# EAGLE design RxT6 (EAGLE 4.13)
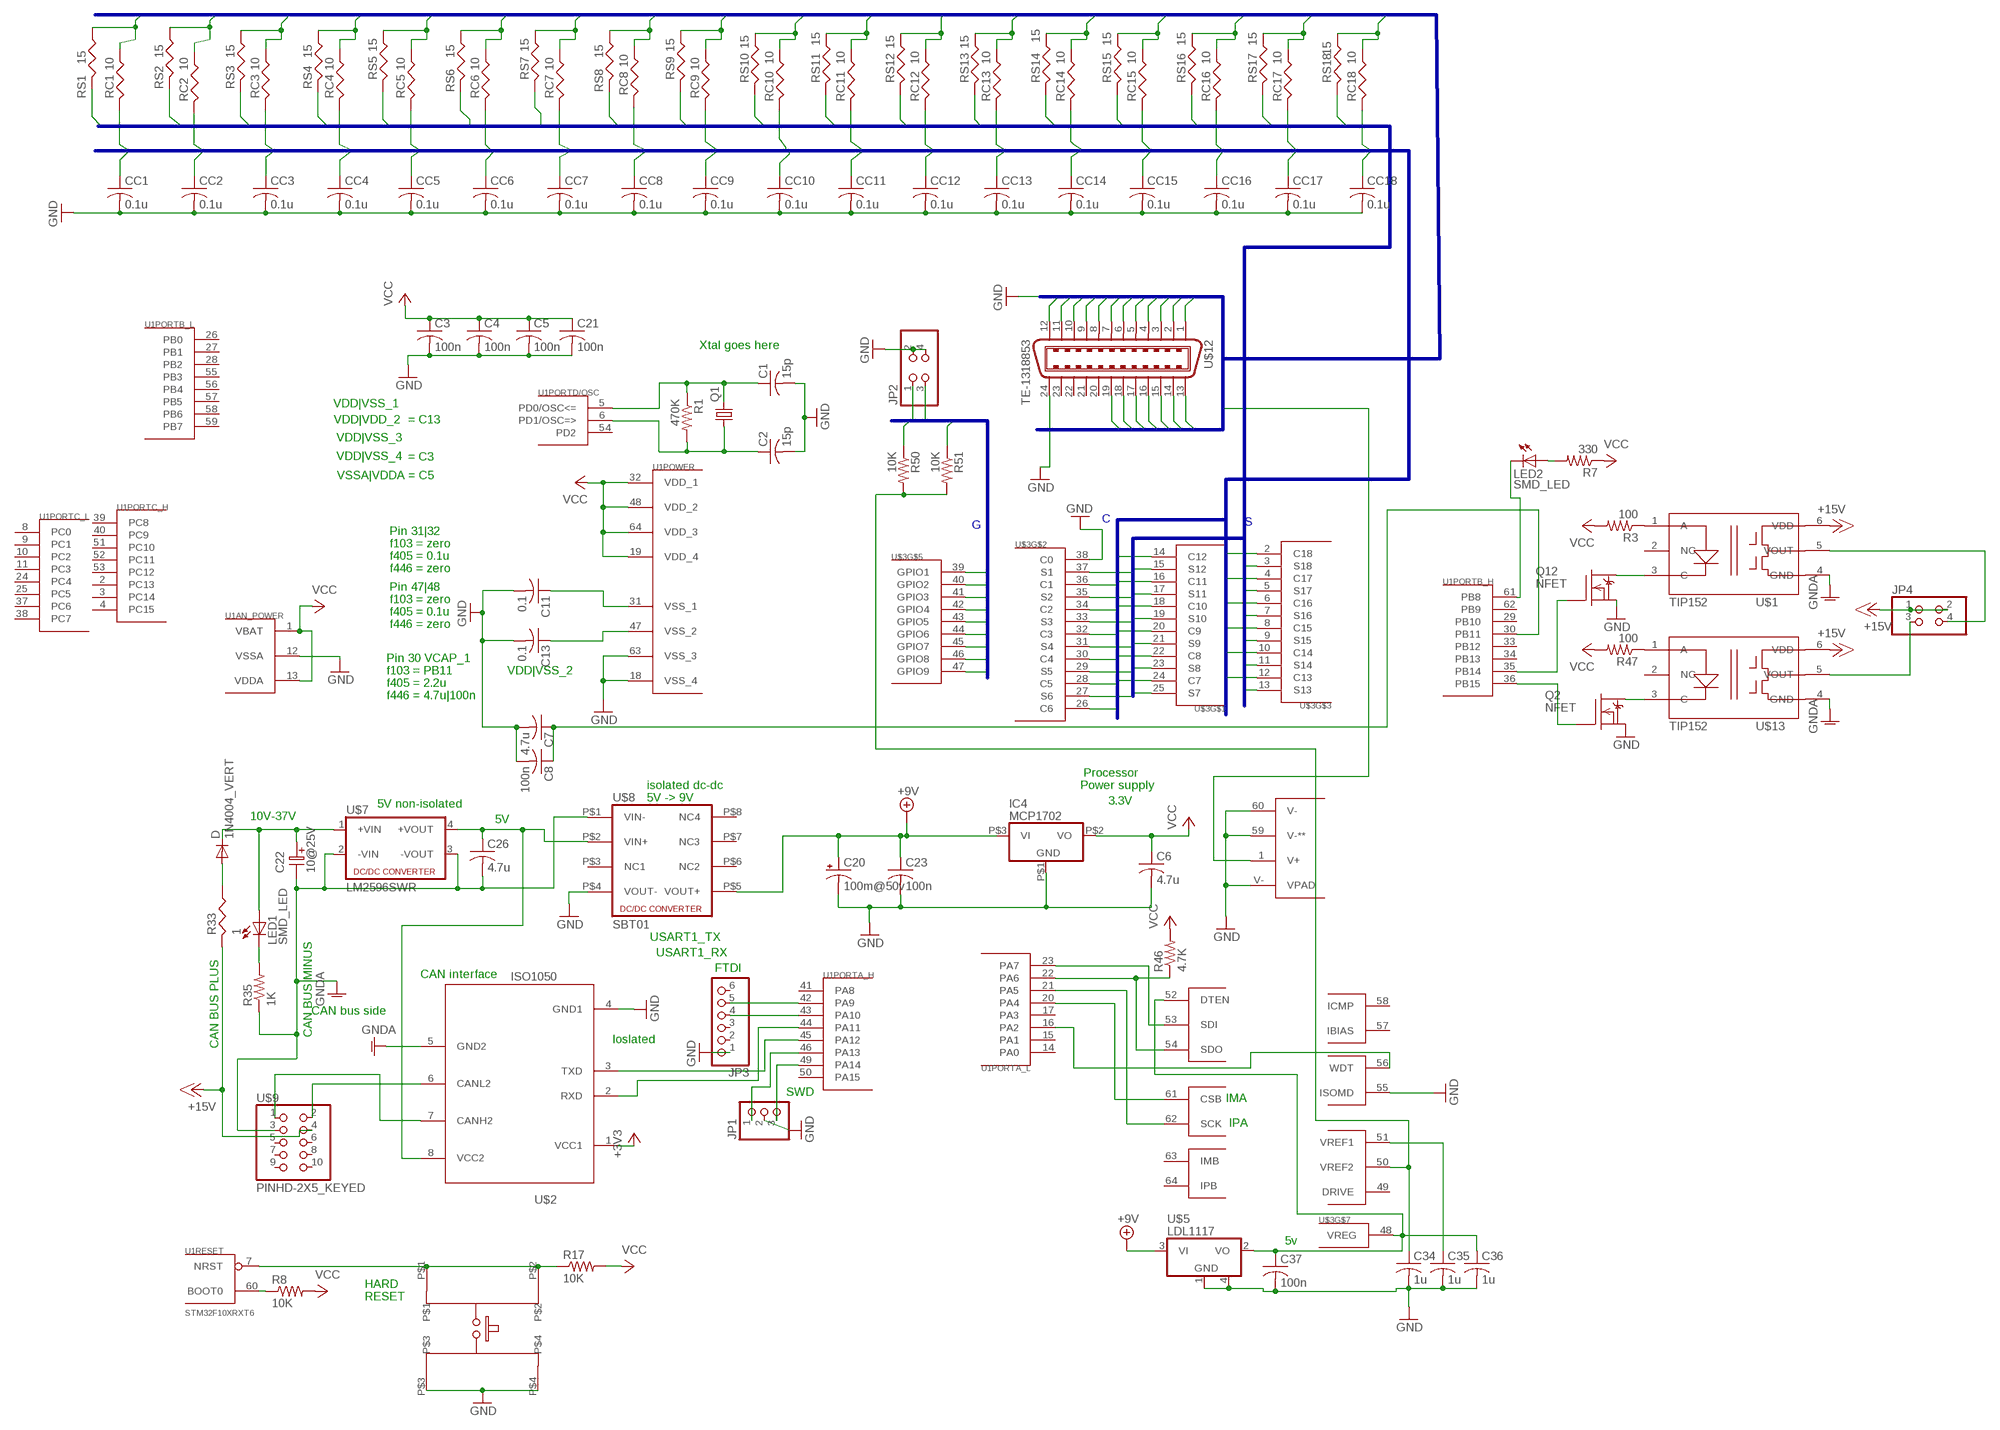
[diagram p0: schematic, sheet 1]

## Parts
C1  15p  C-USC0603  [C0603]
C2  15p  C-USC0603  [C0603]
C3  100n  C-USC0603  [C0603]
C4  100n  C-USC0603  [C0603]
C5  100n  C-USC0603  [C0603]
C6  4.7u  C-USC0805  [C0805]
C7  4.7u  C-USC0603  [C0603]
C8  100n  C-USC0603  [C0603]
C11  0.1  C-USC0603  [C0603]
C13  0.1  C-USC0603  [C0603]
C20  100m@50v  CPOL-USE5-8.5  [E5-8,5]
C21  100n  C-USC0603  [C0603]
C22  10@25V  ELC-2,5L  [ES-2,5L]
C23  100n  C-USC0603  [C0603]
C26  4.7u  C-USC0603  [C0603]
C34  1u  C-USC0603  [C0603]
C35  1u  C-USC0603  [C0603]
C36  1u  C-USC0603  [C0603]
C37  100n  C-USC0603  [C0603]
CC1  0.1u  C-USC0805  [C0805]
CC2  0.1u  C-USC0805  [C0805]
CC3  0.1u  C-USC0805  [C0805]
CC4  0.1u  C-USC0805  [C0805]
CC5  0.1u  C-USC0805  [C0805]
CC6  0.1u  C-USC0805  [C0805]
CC7  0.1u  C-USC0805  [C0805]
CC8  0.1u  C-USC0805  [C0805]
CC9  0.1u  C-USC0805  [C0805]
CC10  0.1u  C-USC0805  [C0805]
CC11  0.1u  C-USC0805  [C0805]
CC12  0.1u  C-USC0805  [C0805]
CC13  0.1u  C-USC0805  [C0805]
CC14  0.1u  C-USC0805  [C0805]
CC15  0.1u  C-USC0805  [C0805]
CC16  0.1u  C-USC0805  [C0805]
CC17  0.1u  C-USC0805  [C0805]
CC18  0.1u  C-USC0805  [C0805]
D  1N4004_VERT  [DO41-10_VERT]
IC4  MCP1702  [SOT-23A]
JP1  PINHD-1X3  [1X03]
JP2  PINHD-2X2  [2X02]
JP3  PINHD-1X6  [1X06]
JP4  PINHD-2X2  [2X02]
LED1  SMD_LED  [SMD_LED]
LED2  SMD_LED  [SMD_LED]
Q1  CRYTALHC49S  [HC49/S]
Q2  NFET  DMN3404L  [SOT-23]
Q12  NFET  DMN3404L  [SOT-23]
R1  470K  R-US_R0603  [R0603]
R3  100  R-US_R0603  [R0603]
R7  330  R-US_R0603  [R0603]
R8  10K  R-US_R0603  [R0603]
R17  10K  R-US_R0603  [R0603]
R33  1  RESUS-S2,5  [RS-2,5]
R35  1K  R-US_R0603  [R0603]
R46  4.7K  R-US_R0603  [R0603]
R47  100  R-US_R0603  [R0603]
R50  10K  R-US_R0603  [R0603]
R51  10K  R-US_R0603  [R0603]
RC1  10  RESUS-S2,5  [RS-2,5]
RC2  10  RESUS-S2,5  [RS-2,5]
RC3  10  RESUS-S2,5  [RS-2,5]
RC4  10  RESUS-S2,5  [RS-2,5]
RC5  10  RESUS-S2,5  [RS-2,5]
RC6  10  RESUS-S2,5  [RS-2,5]
RC7  10  RESUS-S2,5  [RS-2,5]
RC8  10  RESUS-S2,5  [RS-2,5]
RC9  10  RESUS-S2,5  [RS-2,5]
RC10  10  RESUS-S2,5  [RS-2,5]
RC11  10  RESUS-S2,5  [RS-2,5]
RC12  10  RESUS-S2,5  [RS-2,5]
RC13  10  RESUS-S2,5  [RS-2,5]
RC14  10  RESUS-S2,5  [RS-2,5]
RC15  10  RESUS-S2,5  [RS-2,5]
RC16  10  RESUS-S2,5  [RS-2,5]
RC17  10  RESUS-S2,5  [RS-2,5]
RC18  10  RESUS-S2,5  [RS-2,5]
RS1  15  RESUS-S2,5  [RS-2,5]
RS2  15  RESUS-S2,5  [RS-2,5]
RS3  15  RESUS-S2,5  [RS-2,5]
RS4  15  RESUS-S2,5  [RS-2,5]
RS5  15  RESUS-S2,5  [RS-2,5]
RS6  15  RESUS-S2,5  [RS-2,5]
RS7  15  RESUS-S2,5  [RS-2,5]
RS8  15  RESUS-S2,5  [RS-2,5]
RS9  15  RESUS-S2,5  [RS-2,5]
RS10  15  RESUS-S2,5  [RS-2,5]
RS11  15  RESUS-S2,5  [RS-2,5]
RS12  15  RESUS-S2,5  [RS-2,5]
RS13  15  RESUS-S2,5  [RS-2,5]
RS14  15  RESUS-S2,5  [RS-2,5]
RS15  15  RESUS-S2,5  [RS-2,5]
RS16  15  RESUS-S2,5  [RS-2,5]
RS17  15  RESUS-S2,5  [RS-2,5]
RS18  15  RESUS-S2,5  [RS-2,5]
SW1  E-SWITCH  [E-SWITCH]
U1  STM32F10XRXT6  [TQFP64]
U$1  TIP152  SI826  [SDIP6]
U$2  ISO1050  [PDSO-G8]
U$3  LTC6813  [TQFP64_PAD]
U$5  LDL1117  [SO223]
U$7  LM2596SWR  [LM2596SW]
U$8  SBT01  [SBT01]
U$9  PINHD-2X5_KEYED  [2X05_KEYED]
U$12  TE-1318853  [TE-CONN-24]
U$13  TIP152  SI826  [SDIP6]

## Nets
5V_CANSIDE: C26.1 U$2.8(VCC2) U$7.4(+VOUT) U$8.P$2(VIN+)
+3V3: U$2.1(VCC1)
+9V: C20.+ C23.1 IC4.P$3(VI) U$5.3(VI) U$8.P$5(VOUT+)
+12V_RESISTORED: D.A R33.1
+15V: JP4.1 JP4.2 R33.2 U$1.6(VDD) U$9.4 U$13.6(VDD)
BOOT0: R8.1 U1.60(RESET:BOOT0)
C1: CC1.1 RC1.2 U$3.36(C1)
C2: CC2.1 RC2.2 U$3.34(C2)
C3: CC3.1 RC3.2 U$3.32(C3)
C4: CC4.1 RC4.2 U$3.30(C4)
C5: CC5.1 RC5.2 U$3.28(C5)
C6: CC6.1 RC6.2 U$3.26(C6)
C7: CC7.1 RC7.2 U$3.24(C7)
C8: CC8.1 RC8.2 U$3.22(C8)
C9: CC9.1 RC9.2 U$3.20(C9)
C10: CC10.1 RC10.2 U$3.18(C10)
C11: CC11.1 RC11.2 U$3.16(C11)
C12: CC12.1 RC12.2 U$3.14(C12)
C13: CC13.1 RC13.2 U$3.12(C13)
C14: CC14.1 RC14.2 U$3.10(C14)
C15: CC15.1 RC15.2 U$3.8(C15)
C16: CC16.1 RC16.2 U$3.6(C16)
C17: CC17.1 RC17.2 U$3.4(C17)
C18: CC18.1 RC18.2 U$3.2(C18)
CAN_PROTECTED+: C22.1 D.C LED1.A U$7.1(+VIN)
CANH: U$2.7(CANH2) U$9.1
CANL: U$2.6(CANL2) U$9.2
G1: JP2.1 R50.1 U$3.39(GPIO1)
G2: JP2.3 R51.1 U$3.40(GPIO2)
G3: U$3.41(GPIO3)
G4: U$3.42(GPIO4)
G5: U$3.43(GPIO5)
G6: U$3.44(GPIO6)
G7: U$3.45(GPIO7)
G8: U$3.46(GPIO8)
G9: U$3.47(GPIO9)
GND: C1.2 C2.2 C3.2 C4.2 C5.2 C6.2 C7.2 C8.2 C11.2 C13.2 C20.- C21.2 C23.2 C34.2 C35.2 C36.2 C37.2 CC1.2 CC2.2 CC3.2 CC4.2 CC5.2 CC6.2 CC7.2 CC8.2 CC9.2 CC10.2 CC11.2 CC12.2 CC13.2 CC14.2 CC15.2 CC16.2 CC17.2 CC18.2 IC4.P$1(GND) JP1.2 JP2.2 JP2.4 JP3.1 Q2.2(S) Q12.2(S) SW1.P$3 SW1.P$4 U1.12(AN_POWER:VSSA) U1.18(POWER:VSS_4) U1.63(POWER:VSS_3) U$2.4(GND1) U$3.38(C0) U$3.55(ISOMD) U$3.59(V-**) U$3.60(V-) U$3.V-(VPAD) U$5.1(GND) U$5.4(GND1) U$8.P$4(VOUT-) U$12.24
GNDA: C22.2 C26.2 R35.1 U$1.4(GND) U$2.5(GND2) U$7.2(-VIN) U$7.3(-VOUT) U$8.P$1(VIN-) U$9.3 U$13.4(GND)
JTCK: JP1.3 U1.49(PORTA_H:PA14)
JTMS: JP1.1 U1.46(PORTA_H:PA13)
LED_BUS_PWR: LED1.C R35.2
LED|R: LED2.A R7.2
N$3: JP4.3 U$13.5(VOUT)
N$8: JP4.4 U$1.5(VOUT)
N$10: R3.1 U$1.1(A)
N$11: R47.1 U$13.1(A)
N$12: Q12.3(D) U$1.3(C)
N$13: Q2.3(D) U$13.3(C)
N$14: Q2.1(G) U1.36(PORTB_H:PB15)
N$15: Q12.1(G) U1.35(PORTB_H:PB14)
NRST: R17.1 SW1.P$1 SW1.P$2 U1.7(RESET:NRST)
PA2|WDT: U1.16(PORTA_L:PA2) U$3.56(WDT)
PA9_USART1_TX: JP3.5 U1.42(PORTA_H:PA9)
PA10_USART1_RX: JP3.4 U1.43(PORTA_H:PA10)
PA11_CANRXD: U1.44(PORTA_H:PA11) U$2.2(RXD)
PA12-CANTXD: U1.45(PORTA_H:PA12) U$2.3(TXD)
PB8|LED: LED2.C U1.61(PORTB_H:PB8)
PB11|VCAP: C7.1 C8.1 U1.30(PORTB_H:PB11)
PD0_OSC_IN_XTAL: C1.1 Q1.2 R1.1 U1.5(PORTD/OSC:PD0/OSC<=)
PD1_OSC_OUT: C2.1 Q1.1 R1.2 U1.6(PORTD/OSC:PD1/OSC=>)
S1: RS1.2 U$3.37(S1)
S2: RS2.2 U$3.35(S2)
S3: RS3.2 U$3.33(S3)
S4: RS4.2 U$3.31(S4)
S5: RS5.2 U$3.29(S5)
S6: RS6.2 U$3.27(S6)
S7: RS7.2 U$3.25(S7)
S8: RS8.2 U$3.23(S8)
S9: RS9.2 U$3.21(S9)
S10: RS10.2 U$3.19(S10)
S11: RS11.2 U$3.17(S11)
S12: RS12.2 U$3.15(S12)
S13: RS13.2 U$3.13(S13)
S14: RS14.2 U$3.11(S14)
S15: RS15.2 U$3.9(S15)
S16: RS16.2 U$3.7(S16)
S17: RS17.2 U$3.5(S17)
S18: RS18.2 U$3.3(S18)
SP1_MISO-SDO: R46.1 U1.22(PORTA_L:PA6) U$3.54(SDO)
SP1_NSS-CSB: U1.20(PORTA_L:PA4) U$3.61(CSB)
SPI1_MOSI-SDI: U1.23(PORTA_L:PA7) U$3.53(SDI)
SPI1_SCK-CLK: U1.21(PORTA_L:PA5) U$3.62(SCK)
VCC: C3.1 C4.1 C5.1 C6.1 C21.1 IC4.P$2(VO) R3.2 R7.1 R8.2 R17.2 R46.2 R47.2 U1.1(AN_POWER:VBAT) U1.13(AN_POWER:VDDA) U1.19(POWER:VDD_4) U1.32(POWER:VDD_1) U1.48(POWER:VDD_2) U1.64(POWER:VDD_3)
VREF1: C35.1 U$3.51(VREF1)
VREF2: C34.1 R50.2 R51.2 U$3.50(VREF2)
VREG: C36.1 C37.1 U$3.48(VREG) U$3.52(DTEN) U$5.2(VO)
VSS_1: C11.1 U1.31(POWER:VSS_1)
VSS_2: C13.1 U1.47(POWER:VSS_2)
X0: U$12.1
X1: RC1.1 RS1.1 U$12.2
X2: RC2.1 RS2.1 U$12.3
X3: RC3.1 RS3.1 U$12.4
X4: RC4.1 RS4.1 U$12.5
X5: RC5.1 RS5.1 U$12.6
X6: RC6.1 RS6.1 U$12.7
X7: RC7.1 RS7.1 U$12.8
X8: RC8.1 RS8.1 U$12.9
X9: RC9.1 RS9.1 U$12.10
X10: RC10.1 RS10.1 U$12.11
X11: RC11.1 RS11.1 U$12.12
X12: RC12.1 RS12.1 U$12.13
X13: RC13.1 RS13.1 U$12.14
X14: RC14.1 RS14.1 U$12.15
X15: RC15.1 RS15.1 U$12.16
X16: RC16.1 RS16.1 U$12.17
X17: RC17.1 RS17.1 U$12.18
X18: RC18.1 RS18.1 U$3.1(V+) U$12.19
Unconnected: JP3.2 JP3.3 JP3.6 U1.2(PORTC_H:PC13) U1.3(PORTC_H:PC14) U1.4(PORTC_H:PC15) U1.8(PORTC_L:PC0) U1.9(PORTC_L:PC1) U1.10(PORTC_L:PC2) U1.11(PORTC_L:PC3) U1.14(PORTA_L:PA0) U1.15(PORTA_L:PA1) U1.17(PORTA_L:PA3) U1.24(PORTC_L:PC4) U1.25(PORTC_L:PC5) U1.26(PORTB_L:PB0) U1.27(PORTB_L:PB1) U1.28(PORTB_L:PB2) U1.29(PORTB_H:PB10) U1.33(PORTB_H:PB12) U1.34(PORTB_H:PB13) U1.37(PORTC_L:PC6) U1.38(PORTC_L:PC7) U1.39(PORTC_H:PC8) U1.40(PORTC_H:PC9) U1.41(PORTA_H:PA8) U1.50(PORTA_H:PA15) U1.51(PORTC_H:PC10) U1.52(PORTC_H:PC11) U1.53(PORTC_H:PC12) U1.54(PORTD/OSC:PD2) U1.55(PORTB_L:PB3) U1.56(PORTB_L:PB4) U1.57(PORTB_L:PB5) U1.58(PORTB_L:PB6) U1.59(PORTB_L:PB7) U1.62(PORTB_H:PB9) U$1.2(NC) U$3.57(IBIAS) U$3.58(ICMP) U$3.63(IMB) U$3.64(IPB) U$8.P$3(NC1) U$8.P$6(NC2) U$8.P$7(NC3) U$8.P$8(NC4) U$9.5 U$9.6 U$9.7 U$9.8 U$9.9 U$9.10 U$12.20 U$12.21 U$12.22 U$12.23 U$13.2(NC)

## Buses
G[1..9]
C[0..18]
X[1..18],GND
S[1..18]

## Notes on the sheet
- Xtal goes here
- VDD|VSS_1
- VDD|VDD_2 | = C13
- VDD|VSS_3
- VDD|VSS_4
- = C3
- VSSA|VDDA = C5
- C | S
- G
- Pin 31|32
- f103 = zero
- f405 = 0.1u
- f446 = zero
- Pin 47|48
- f103 = zero
- f405 = 0.1u
- f446 = zero
- Pin 30 VCAP_1
- f103 = PB11 | VDD|VSS_2
- f405 = 2.2u
- f446 = 4.7u|100n
- Processor
- isolated dc-dc | Power supply
- 5V -> 9V | 3.3V
- 5V non-isolated
- 10V-37V | 5V
- USART1_TX
- CAN BUS PLUS | USART1_RX
- FTDI
- CAN interface
- CAN bus side
- CAN BUS MINUS
- Ioslated
- SWD
- IMA
- IPA
- 5v
- HARD
- RESET

## Power pins joined to a net without a drawn wire
DRIVE: U$3.49(DRIVE)

## Library data of the parts
C1-C8 C11 C13 C21 C23 C26 C34-C37 CC1-CC18 = rcl:C-US: CAPACITOR, American symbol
C20 = rcl:CPOL-US: POLARIZED CAPACITOR, American symbol
C22 = DEH:ELC-2,5L
D = diode:1N4004_VERT
IC4 = linear:MCP1702
JP1 = pinhead:PINHD-1X3: PIN HEADER
JP2 JP4 = pinhead:PINHD-2X2: PIN HEADER
JP3 = pinhead:PINHD-1X6: PIN HEADER
LED1 LED2 = led:SMD_LED
Q1 = crystal:CRYTAL: CRYSTAL
Q2 Q12 = transistor-fet:DMN3404L
R1 R3 R7 R8 R17 R35 R46 R47 R50 R51 = rcl:R-US_: RESISTOR, American symbol
R33 RC1-RC18 RS1-RS18 = DEH:RESUS-S2,5
SW1 = switch-misc:E-SWITCH
U1 = stm32:STM32F10XRXT6: STM32F101/103 64pin LQFP
U$1 U$13 = DEH:SI826
U$2 = texas:ISO1050
U$3 = stm32:LTC6813
U$5 = DEH:LDL1117
U$7 = dc-dc-converter:LM2596SWR
U$8 = dc-dc-converter:SBT01
U$9 = pinhead:PINHD-2X5_KEYED
U$12 = DEH:TE-1318853

## Board
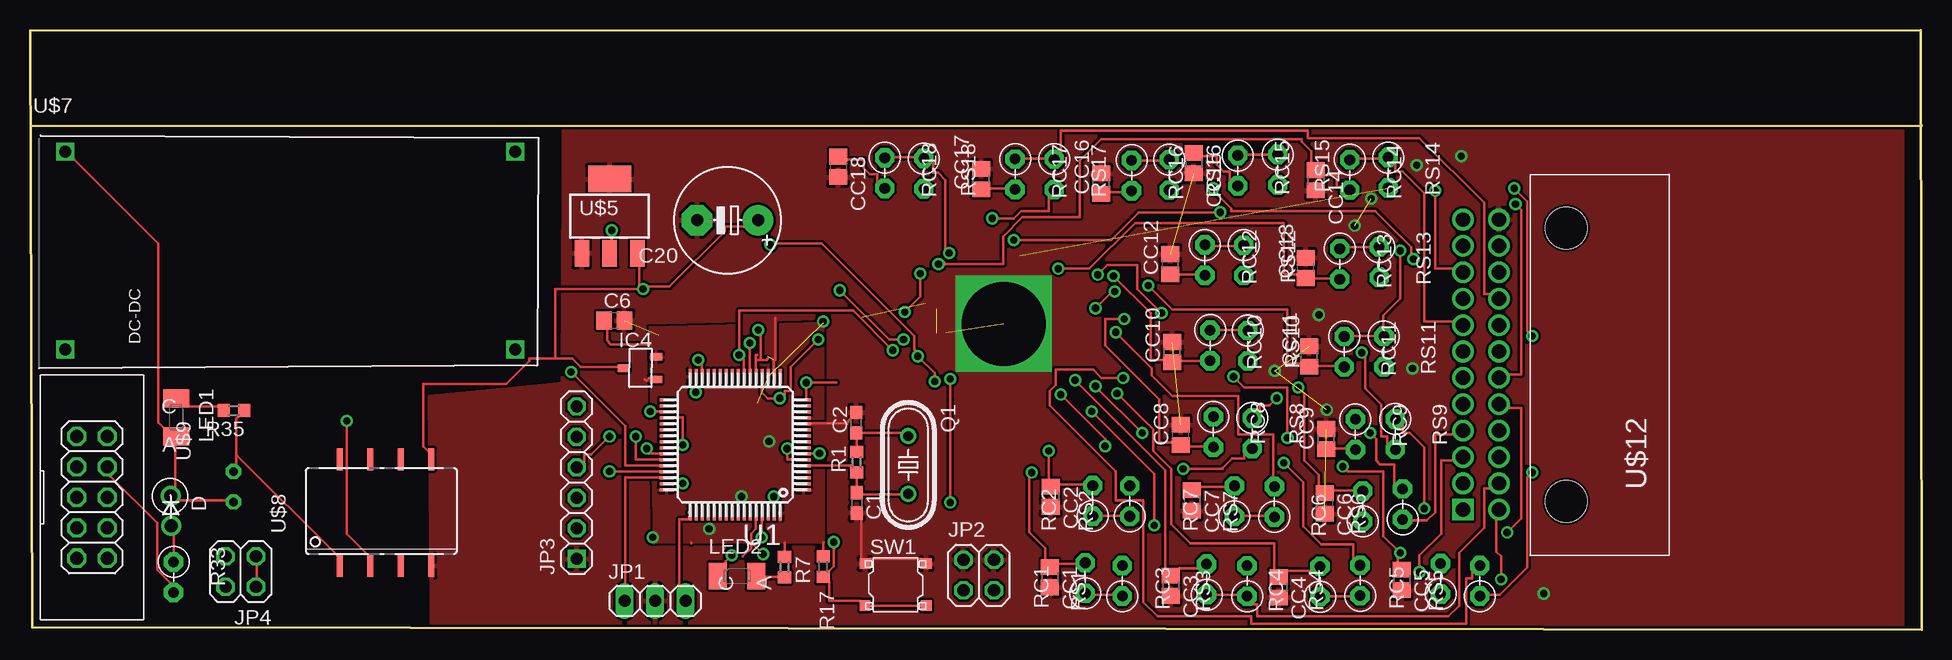
[diagram p1: board, top side]
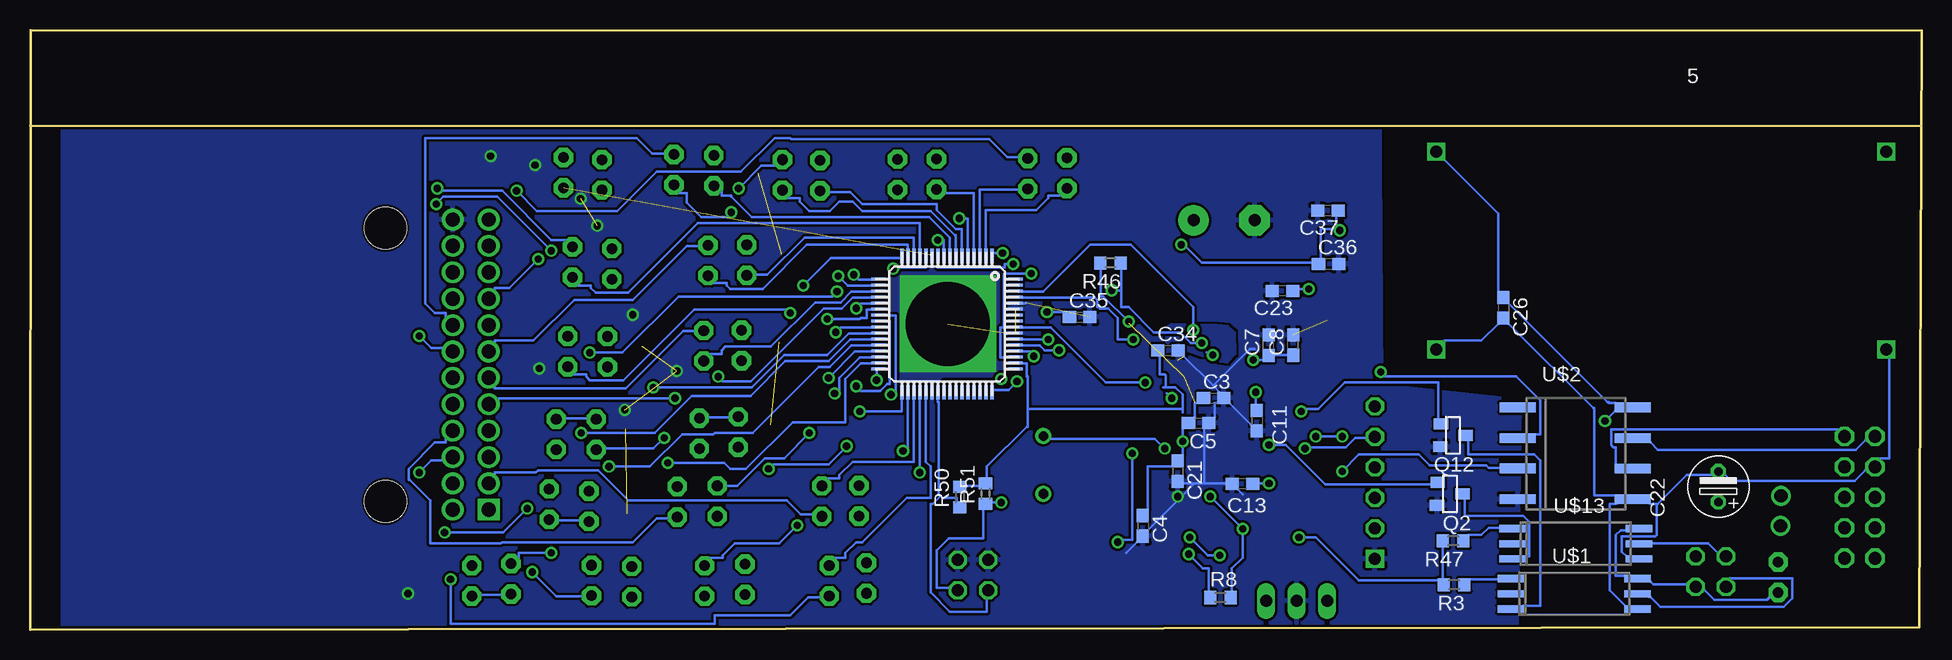
[diagram p2: board, bottom side, seen from below]

Size 157.64 x 50.02 mm. Coordinates in mm from the lower left corner, seen from the top.
Outline: 0.07,41.98 157.64,42.06
Outline: 0.19,0.21 0,49.94 157.57,50.02 157.63,0 0.19,0.21
Copper layers (1*16): Top 0.035mm / dielectric 1.5mm / Bottom 0.035mm
Design rules "default": minimum track width 8mil, minimum drill 0.6mm, track to track 0.2083mm, track to pad 8mil, pad to pad 8mil, via to via 8mil, smd to smd 0mil, copper to edge 8mil, drill to drill 8mil, minimum pad ring 10mil, minimum via ring 8mil, stop-mask expansion 4mil, vias tented up to drill 0mil, thermal gap 10mil

### Footprints (pad centres in the part's own frame; a part is rotated, then mirrored left to right if it is on the bottom)
C0603 = smd 1.1 x 1: 1 -0.85,0; 2 0.85,0
C0805 = smd 1.3 x 1.5: 1 -0.85,0; 2 0.85,0
E5-8,5 = drill 1 pad 2.54 round: + -2.54,0 | drill 1 pad 2.54 octagon: - 2.54,0
ES-2,5L = drill 0.711 pad 1.27 octagon: 1 0,0; 2 2.54,0
DO41-10_VERT = drill 1.1 round: A 2.58,0.05; C 0.07,0
SOT-23A = smd 0.6 x 1: P$1 -0.95,-1.35; P$2 0.95,-1.35; P$3 0,1.35
1X03 = drill 1 long: 1 -2.54,0; 2 0,0; 3 2.54,0
2X02 = drill 1.016 octagon: 1 -1.27,-1.27; 2 -1.27,1.27; 3 1.27,-1.27; 4 1.27,1.27
1X06 = drill 1 square: 1 -6.35,0 | drill 1 octagon: 2 -3.81,0; 3 -1.27,0; 4 1.27,0; 5 3.81,0; 6 6.35,0
SMD_LED = smd 2.2 x 1.5: A 0,1.6; C 0,-1.6
HC49/S = drill 0.813 round: 1 -2.413,0; 2 2.413,0
SOT-23 = smd 0.9 x 1.2: 1 -1,-1.006; 2 0.9,-1.056; 3 -0.05,1.056
R0603 = smd 1 x 1.1: 1 -0.85,0; 2 0.85,0
RS-2,5 = drill 0.889 pad 1.6 octagon: 1 0,0; 2 2.54,0
E-SWITCH = smd 0.9 x 0.9: P$1 -2.55,1.75; P$2 2.55,1.75; P$3 -2.55,-1.75; P$4 2.55,-1.75
TQFP64 = smd 1.2 x 0.26: 1 -5.7,3.75; 2 -5.7,3.25; 3 -5.7,2.75; 4 -5.7,2.25; 5 -5.7,1.75; 6 -5.7,1.25; 7 -5.7,0.75; 8 -5.7,0.25; 9 -5.7,-0.25; 10 -5.7,-0.75; 11 -5.7,-1.25; 12 -5.7,-1.75; 13 -5.7,-2.25; 14 -5.7,-2.75; 15 -5.7,-3.25; 16 -5.7,-3.75; 33 5.7,-3.75; 34 5.7,-3.25; 35 5.7,-2.75; 36 5.7,-2.25; 37 5.7,-1.75; 38 5.7,-1.25; 39 5.7,-0.75; 40 5.7,-0.25; 41 5.7,0.25; 42 5.7,0.75; 43 5.7,1.25; 44 5.7,1.75; 45 5.7,2.25; 46 5.7,2.75; 47 5.7,3.25; 48 5.7,3.75 | smd 0.26 x 1.2: 17 -3.75,-5.7; 18 -3.25,-5.7; 19 -2.75,-5.7; 20 -2.25,-5.7; 21 -1.75,-5.7; 22 -1.25,-5.7; 23 -0.75,-5.7; 24 -0.25,-5.7; 25 0.25,-5.7; 26 0.75,-5.7; 27 1.25,-5.7; 28 1.75,-5.7; 29 2.25,-5.7; 30 2.75,-5.7; 31 3.25,-5.7; 32 3.75,-5.7; 49 3.75,5.7; 50 3.25,5.7; 51 2.75,5.7; 52 2.25,5.7; 53 1.75,5.7; 54 1.25,5.7; 55 0.75,5.7; 56 0.25,5.7; 57 -0.25,5.7; 58 -0.75,5.7; 59 -1.25,5.7; 60 -1.75,5.7; 61 -2.25,5.7; 62 -2.75,5.7; 63 -3.25,5.7; 64 -3.75,5.7
SDIP6 = smd 0.6 x 2.2: 1 -1.895,-5.33; 2 -0.625,-5.33; 3 0.645,-5.33; 4 0.645,5.22; 5 -0.625,5.22; 6 -1.895,5.22
PDSO-G8 = smd 0.8 x 3: 1 -3.825,-4.8; 2 -1.275,-4.8; 3 1.265,-4.78; 4 3.825,-4.8; 5 3.825,4.8; 6 1.275,4.8; 7 -1.275,4.81; 8 -3.825,4.81
TQFP64_PAD = smd 1.2 x 0.26: 1 -5.7,3.75; 2 -5.7,3.25; 3 -5.7,2.75; 4 -5.7,2.25; 5 -5.7,1.75; 6 -5.7,1.25; 7 -5.7,0.75; 8 -5.7,0.25; 9 -5.7,-0.25; 10 -5.7,-0.75; 11 -5.7,-1.25; 12 -5.7,-1.75; 13 -5.7,-2.25; 14 -5.7,-2.75; 15 -5.7,-3.25; 16 -5.7,-3.75; 33 5.7,-3.75; 34 5.7,-3.25; 35 5.7,-2.75; 36 5.7,-2.25; 37 5.7,-1.75; 38 5.7,-1.25; 39 5.7,-0.75; 40 5.7,-0.25; 41 5.7,0.25; 42 5.7,0.75; 43 5.7,1.25; 44 5.7,1.75; 45 5.7,2.25; 46 5.7,2.75; 47 5.7,3.25; 48 5.7,3.75 | smd 0.26 x 1.2: 17 -3.75,-5.7; 18 -3.25,-5.7; 19 -2.75,-5.7; 20 -2.25,-5.7; 21 -1.75,-5.7; 22 -1.25,-5.7; 23 -0.75,-5.7; 24 -0.25,-5.7; 25 0.25,-5.7; 26 0.75,-5.7; 27 1.25,-5.7; 28 1.75,-5.7; 29 2.25,-5.7; 30 2.75,-5.7; 31 3.25,-5.7; 32 3.75,-5.7; 49 3.75,5.7; 50 3.25,5.7; 51 2.75,5.7; 52 2.25,5.7; 53 1.75,5.7; 54 1.25,5.7; 55 0.75,5.7; 56 0.25,5.7; 57 -0.25,5.7; 58 -0.75,5.7; 59 -1.25,5.7; 60 -1.75,5.7; 61 -2.25,5.7; 62 -2.75,5.7; 63 -3.25,5.7; 64 -3.75,5.7 | smd 5.8 x 5.8: V- 0,0
SO223 = smd 1.219 x 2.235: 1 -2.311,-3.099; 2 0,-3.099; 3 2.311,-3.099 | smd 3.6 x 2.2: 4 0,3.099
LM2596SW = drill 1 square: 1 0,16.5; 2 0,0; 3 37.5,0; 4 37.5,16.5
SBT01 = smd 0.5 x 1.85: P$1 -3.5,-4.63; P$2 -0.96,-4.63; P$3 1.58,-4.63; P$4 4.12,-4.63; P$5 4.12,4.26; P$6 1.58,4.26; P$7 -0.96,4.26; P$8 -3.5,4.26
2X05_KEYED = drill 1.067 octagon: 1 -5.08,-1.27; 2 -5.08,1.27; 3 -2.54,-1.27; 4 -2.54,1.27; 5 0,-1.27; 6 0,1.27; 7 2.54,-1.27; 8 2.54,1.27; 9 5.08,-1.27; 10 5.08,1.27
TE-CONN-24 = drill 1.2 square: 1 12.1,0 | drill 1.2 round: 2 12.1,3; 3 9.9,0; 4 9.9,3; 5 7.7,0; 6 7.7,3; 7 5.5,0; 8 5.5,3; 9 3.3,0; 10 3.3,3; 11 1.1,0; 12 1.1,3; 13 -1.1,0; 14 -1.1,3; 15 -3.3,0; 16 -3.3,3; 17 -5.5,0; 18 -5.5,3; 19 -7.7,0; 20 -7.7,3; 21 -9.9,0; 22 -9.9,3; 23 -12.1,0; 24 -12.1,3 | hole 3.5: 11.4,8.6; -11.4,8.6

### Placement (x,y rotation side)
C1  68.89,10.58 270 top
C2  68.87,17.27 90 top
C3  59,19.32 0 bottom
C4  64.9,8.67 270 bottom
C5  60.25,17.25 0 bottom
C6  48.69,25.81 0 top
C7  54.42,23.73 90 bottom
C8  52.38,23.74 90 bottom
C11  55.4,17.44 270 bottom
C13  56.6,12.17 180 bottom
C20  58.13,34.15 180 top
C21  62,13.23 270 bottom
C22  16.95,10.66 90 bottom
C23  53.26,28.26 180 bottom
C26  34.86,26.85 270 bottom
C34  62.8,23.29 0 bottom
C35  70.17,26.08 0 bottom
C36  49.42,30.52 0 bottom
C37  49.47,34.95 180 bottom
CC1  84.98,4.39 270 top
CC2  85.06,11.1 270 top
CC3  95.05,3.68 270 top
CC4  104.05,3.55 270 top
CC5  114.3,4.16 270 top
CC6  107.88,10.53 270 top
CC7  96.83,10.78 270 top
CC8  95.89,16.25 90 top
CC9  108.01,15.9 90 top
CC10  95.19,23.15 90 top
CC11  106.6,22.79 90 top
CC12  95.04,30.48 90 top
CC13  106.31,30.18 90 top
CC14  107.15,37.48 270 top
CC15  96.99,38.92 270 top
CC16  89.28,37.2 90 top
CC17  79.27,37.59 90 top
CC18  67.34,38.61 270 top
D  11.72,11.24 270 top
IC4  50.82,21.82 90 top
JP1  52.09,2.4 0 top
JP2  79.06,4.56 0 top
JP3  45.56,12.28 90 top
JP4  17.57,4.85 180 top
LED1  12.19,17.71 180 top
LED2  58.92,4.49 270 top
Q1  73.19,13.74 270 top
Q2  39.32,11.28 270 bottom
Q12  39.06,16.17 270 bottom
R1  68.89,13.97 90 top
R3  38.96,3.76 180 bottom
R7  62.87,5.23 270 top
R8  58.44,2.69 0 bottom
R17  66.1,5.26 90 top
R33  11.96,5.65 270 top
R35  17,18.28 180 top
R46  67.6,30.59 180 bottom
R47  39.05,7.42 180 bottom
R50  80.15,11.05 90 bottom
R51  78.01,11.35 90 bottom
RC1  87.94,3.04 90 top
RC2  88.56,9.48 90 top
RC3  98.05,2.93 90 top
RC4  107.5,2.74 90 top
RC5  117.55,2.98 90 top
RC6  111.06,9.03 90 top
RC7  100.37,9.46 90 top
RC8  98.62,17.76 270 top
RC9  110.45,17.56 270 top
RC10  98.34,24.98 270 top
RC11  109.52,24.46 270 top
RC12  97.91,32.1 270 top
RC13  109.15,31.78 270 top
RC14  109.98,39.2 270 top
RC15  100.65,39.56 270 top
RC16  91.8,39.15 270 top
RC17  82.09,39.26 270 top
RC18  71.23,39.36 270 top
RS1  91.03,2.81 90 top
RS2  91.65,9.46 90 top
RS3  101.42,2.8 90 top
RS4  110.84,2.84 90 top
RS5  120.82,2.81 90 top
RS6  114.38,9.2 90 top
RS7  103.7,9.4 90 top
RS8  101.86,17.65 270 top
RS9  113.78,17.57 270 top
RS10  101.49,24.95 270 top
RS11  112.83,24.47 270 top
RS12  101.14,32.07 270 top
RS13  112.43,31.93 270 top
RS14  113.18,39.39 270 top
RS15  103.98,39.64 270 top
RS16  94.94,39.21 270 top
RS17  85.35,39.24 270 top
RS18  74.49,39.31 270 top
SW1  72.14,3.77 180 top
U1  58.76,15.43 180 top
U$1  28.9,2.37 270 bottom
U$2  28.87,14.72 270 bottom
U$3  81.22,25.49 270 bottom
U$5  48.3,34.5 0 top
U$7  2.95,23.37 0 top
U$8  29.33,9.96 0 top
U$9  5.16,11.05 270 top
U$12  119.41,22.11 270 top
U$13  28.77,6.55 270 bottom

### Tracks (layer width: path | path; a pad name or v marks a point on that pad's centre or on a via)
5V_CANSIDE  (via drill 0.6)
  Top 0.203: v26.39,17.41 26.39,8.01 28.19,6.21 U$8.P$2
  Bottom 0.203: v26.39,17.41 25.59,18.21 25.49,18.21 U$2.8 25.49,18.91 26.09,18.91 26.09,19.01 26.19,19.01 34.39,27.21 C26.1 35.29,28.21 35.29,34.71 U$7.4
+9V  (via drill 0.6)
  Top 0.203: v51.09,28.41 50.79,28.71 50.79,30.31 U$5.3 | 43.79,22.61 41.59,22.61 41.59,22.41 39.69,20.51 32.79,20.51 32.79,15.31 33.29,14.81 U$8.P$5 | 43.79,22.61 45.19,22.61 45.89,21.91 48.99,21.91 IC4.P$3 | v51.09,28.41 43.79,28.41 43.79,22.61 | C20.+ 59.49,33.61 57.89,33.61 57.89,33.21 53.29,28.61 51.59,28.61 v51.09,28.41
  Bottom 0.203: v51.09,28.41 51.89,28.41 C23.1
+12V_RESISTORED
  Top 0.203: R33.1 11.99,6.41 11.99,7.91 D.A
+15V
  Top 0.203: JP4.2 18.89,4.31 18.89,5.41 JP4.1 | U$9.4 6.69,12.81 10.59,8.91 10.59,5.01 11.69,3.91 R33.2
  Bottom 0.203: U$13.6 24.59,8.31 25.09,8.31 25.49,7.91 25.49,4.51 24.69,4.51 U$1.6 22.59,4.01 22.39,3.81 19.59,3.81 JP4.2 18.09,3.31 17.29,2.51 12.89,2.51 12.69,2.71 R33.2
BOOT0  (via drill 0.6)
  Top 0.203: 59.39,6.11 60.09,6.81 60.09,7.21 | 60.09,7.21 60.09,8.01 60.49,8.41 60.49,9.21 U1.60 | v61.09,6.31 60.19,7.21 60.09,7.21
  Bottom 0.203: v61.09,6.31 59.89,5.11 59.39,5.11 59.39,3.21 R8.1
C1  (via drill 0.6)
  Top 0.203: v83.49,13.11 83.29,12.91 83.29,8.11 84.59,6.81 84.59,5.81 CC1.1 85.69,5.51 87.19,5.51 RC1.2
  Bottom 0.203: v83.49,13.11 83.49,19.21 U$3.36
C2  (via drill 0.6)
  Top 0.203: v84.89,14.91 84.89,12.51 CC2.1 85.79,12.11 87.79,12.11 RC2.2
  Bottom 0.203: v84.89,14.91 84.49,14.91 84.49,19.21 U$3.34
C3  (via drill 0.6)
  Top 0.203: v87.09,20.81 94.59,13.31 94.59,5.11 CC3.1 95.79,5.11 97.29,5.11 RC3.2
  Bottom 0.203: v87.09,20.81 87.09,21.71 U$3.32
C4  (via drill 0.6)
  Top 0.203: v90.59,19.71 93.59,16.71 93.59,14.91 95.09,13.41 95.09,8.81 96.69,7.21 103.69,7.21 103.69,5.01 CC4.1 104.79,4.91 106.79,4.91 RC4.2
  Bottom 0.203: v90.59,19.71 90.19,19.71 90.19,21.01 88.49,22.71 87.49,22.71 U$3.30
C5  (via drill 0.6)
  Top 0.203: v109.39,13.61 109.79,13.21 112.79,13.21 112.79,7.81 113.99,6.61 113.99,6.41 | 113.99,6.41 113.99,5.61 CC5.1 | 113.99,6.41 v114.19,6.41
  Bottom 0.203: v109.39,13.61 105.99,13.61 103.29,16.31 100.69,16.31 100.59,16.41 97.39,16.41 91.89,21.91 90.99,21.91 89.19,23.71 87.49,23.71 U$3.28 | v114.19,6.41 116.89,6.41 116.89,5.91 RC5.2
C6  (via drill 0.6)
  Top 0.203: v105.69,20.21 106.19,19.71 106.19,14.11 107.39,12.91 107.39,12.01 CC6.1 108.59,11.61 110.29,11.61 RC6.2
  Bottom 0.203: v105.69,20.21 97.49,20.21 94.79,22.91 91.19,22.91 89.39,24.71 87.49,24.71 U$3.26
C7  (via drill 0.6)
  Top 0.203: v88.79,20.31 v92.69,16.41 | CC7.1 97.49,11.91 99.59,11.91 RC7.2
  Bottom 0.203: v88.79,20.31 88.39,19.91 86.79,19.91 86.19,20.51 85.99,20.51 85.99,25.71 86.39,25.71 U$3.24 | v92.69,16.41 94.79,14.31 96.39,14.31 98.69,12.01 99.59,12.01 RC7.2
C8  (via drill 0.6)
  Top 0.203: v91.19,25.91 89.59,25.91 89.59,23.71 94.09,19.21 94.09,15.71 94.19,15.61 95.19,15.61 CC8.1 96.59,15.31 97.89,15.31 RC8.2
  Bottom 0.203: v91.19,25.91 88.49,25.91 88.39,26.01 87.89,26.01 87.89,26.71 87.49,26.71 U$3.22
C9  (via drill 0.6)
  Top 0.203: v100.29,21.11 101.19,20.21 104.79,20.21 v104.79,16.01 | CC9.1 108.69,15.11 109.69,15.11 RC9.2
  Bottom 0.203: v100.29,21.11 99.89,20.71 97.59,20.71 91.49,26.81 89.99,26.81 89.09,27.71 87.49,27.71 U$3.20 | v104.79,16.01 105.69,15.11 109.69,15.11 RC9.2
C10  (via drill 0.6)
  Top 0.203: v90.29,29.51 93.39,26.41 93.39,22.61 93.49,22.51 94.49,22.51 CC10.1 95.89,22.41 97.59,22.41 RC10.2
  Bottom 0.203: v90.29,29.51 89.49,28.71 87.49,28.71 U$3.18
C11  (via drill 0.6)
  Top 0.203: v93.19,28.71 95.19,26.71 104.79,26.71 104.79,22.31 104.89,22.21 105.89,22.21 CC11.1 107.29,22.01 108.79,22.01 RC11.2
  Bottom 0.203: v93.19,28.71 90.89,31.01 85.09,31.01 U$3.16
C12
  Top 0.203: CC12.1 95.69,29.61 97.19,29.61 RC12.2
  Bottom 0.203: U$3.14 83.99,31.71 83.99,32.71 93.09,32.71 96.19,29.61 97.19,29.61 RC12.2
C13  (via drill 0.6)
  Top 0.203: v85.69,30.11 88.29,30.11 92.09,33.91 104.49,33.91 104.49,29.81 104.69,29.61 105.59,29.61 CC13.1 106.99,29.31 108.39,29.31 RC13.2
  Bottom 0.203: v85.69,30.11 85.69,30.21 82.99,30.21 82.99,30.61 U$3.12
C14  (via drill 0.6)
  Top 0.203: v75.71,30.49 76.19,30.61 76.29,30.51 81.09,30.51 81.09,32.81 82.69,34.41 87.49,34.41 87.49,39.11 89.29,40.91 105.99,40.91 105.99,40.71 106.79,39.91 106.79,38.91 CC14.1 107.89,37.91 108.89,37.91 108.89,36.91 109.19,36.91 RC14.2
  Bottom 0.203: v75.71,30.49 75.69,30.51 76.39,30.51 76.39,30.21 81.99,30.21 81.99,30.61 U$3.10
C15
  Top 0.203: CC15.1 97.69,39.51 98.89,39.51 98.89,38.81 99.49,38.21 99.99,38.21 99.99,37.41 RC15.2
  Bottom 0.203: U$3.8 80.99,31.71 80.99,32.71 82.69,34.41 97.49,34.41 99.19,36.11 99.19,36.21 99.99,36.21 99.99,36.61 RC15.2
C16
  Top 0.203: CC16.1 89.99,36.51 91.09,36.51 RC16.2
  Bottom 0.203: U$3.6 79.99,31.71 79.99,33.41 80.49,33.41 82.09,35.01 82.09,35.51 88.29,35.51 89.29,36.51 91.09,36.51 RC16.2
C17
  Top 0.203: CC17.1 79.99,36.81 81.29,36.81 RC17.2
  Bottom 0.203: U$3.4 78.99,31.71 78.99,36.41 81.29,36.41 RC17.2
C18
  Top 0.203: CC18.1 67.99,39.21 69.49,39.21 69.49,38.51 69.99,38.01 70.59,38.01 70.59,37.31 RC18.2
  Bottom 0.203: U$3.2 77.99,31.71 77.99,35.01 73.79,35.01 72.79,36.01 72.79,36.21 71.69,36.21 RC18.2
CAN_PROTECTED+
  Top 0.203: C22.1 16.39,10.81 12.49,10.81 D.C 12.09,11.91 12.09,15.41 LED1.A 11.19,16.81 10.69,17.31 10.69,32.21 3.69,39.21 U$7.1
CANH
  Bottom 0.203: U$2.7 22.59,15.61 21.99,15.01 5.49,15.01 4.69,15.81 U$9.1
CANL
  Bottom 0.203: U$2.6 25.49,13.81 25.49,15.21 25.69,15.21 25.89,15.41 25.89,16.71 6.89,16.71 U$9.2
G1
  Bottom 0.203: 81.74,11.16 81.89,11.31 81.89,19.01 81.99,19.01 81.99,19.21 U$3.39 | 81.74,11.16 81.59,11.01 80.39,11.01 80.39,10.61 R50.1 | JP2.1 77.89,2.61 77.89,1.51 80.99,1.51 82.59,3.11 82.59,10.51 82.39,10.51 81.74,11.16
G2  (via drill 0.6)
  Top 0.203: v76.69,10.61 v76.69,20.91
  Bottom 0.203: JP2.3 81.09,3.51 82.09,3.51 82.09,6.61 81.09,7.61 78.19,7.61 78.19,10.01 R51.1 77.49,10.61 v76.69,10.61 | v76.69,20.91 76.69,20.71 81.49,20.71 81.49,20.31 U$3.40
GND  (via drill 0.6, 7)  (11 unrouted)
  Top 0.203: C1.2 69.29,9.21 69.29,5.91 SW1.P$4 69.99,5.91 74.29,5.91 SW1.P$3 75.09,5.51 | 69.29,17.61 C2.2 68.39,17.61 68.09,17.31 68.09,17.21 64.99,17.21 U1.12 | IC4.P$1 51.69,21.01 51.59,21.01 51.39,20.81 51.21,20.87 | v61.99,11.11 61.99,10.31 U1.63 | U1.18 61.99,21.71 61.99,22.51 62.09,22.51 62.09,25.81 62.09,25.99
  Bottom 0.203: 60.69,12.21 61.59,12.21 C21.2 | 59.79,12.21 60.69,12.21 | 59.79,12.21 57.99,12.21 C13.2 56.99,11.71 56.59,11.31 | 61.84,10.96 60.69,12.11 60.69,12.21 | 61.84,10.96 64.49,8.31 C4.2 65.39,7.31 66.29,6.41 | 61.84,10.96 v61.99,11.11 | C11.2 55.89,17.11 57.69,18.91 C3.2 | C3.2 58.69,18.91 58.89,18.91 58.89,17.71 C5.2 59.79,16.81 59.79,12.21 | 59.04,20.36 58.49,19.81 C3.2 | 59.04,20.36 61.49,22.81 | 55.59,23.41 55.99,23.41 59.04,20.36 | U$3.55 76.09,24.71 76.19,24.71 76.33,24.74 | U$3.38 82.49,20.31 82.49,20.41 82.47,20.6 | 74.64,27.24 74.79,27.21 74.99,27.21 U$3.60
  other vias: 81.14,25.52 110.38,33.69 111.76,35.95 115.55,38.75 119.26,39.51 107.41,26.27 115.21,21.78 126.14,3.02 103.73,21.58 108.08,18.35
  pour Bottom (rank 4): 33.84,-2.14 154.86,-1.58 154.86,45.2 45.25,45.2 45.09,20.36 33.52,19.13
  pour Top (rank 4): 33.48,-2.3 156.02,-2.3 156.02,46.4 44.5,46.4 44.38,20.44 33.33,19.39 33.48,4.2
GNDA
  Top 0.203: 17.19,14.51 17.19,13.81 C22.2 | 17.19,14.51 17.19,17.61 17.39,17.81 R35.1 | U$8.P$1 25.59,6.21 17.29,14.51 17.19,14.51
  Bottom 0.203: U$1.4 24.69,2.01 25.99,3.31 25.99,10.51 25.49,10.51 U$2.5 | 22.09,10.51 22.09,7.91 22.19,7.81 24.99,7.81 24.99,6.51 24.59,6.11 U$13.4 | 22.09,10.51 22.59,10.51 U$2.5 | U$2.5 25.49,11.21 27.29,11.21 27.29,18.51 27.39,18.51 34.39,25.51 C26.2 35.29,25.51 36.69,24.11 39.79,24.11 U$7.3 | 22.09,10.51 21.99,10.51 19.59,12.91 17.49,12.91 C22.2 16.39,12.91 15.89,12.41 5.59,12.41 4.69,13.31 U$9.3 3.49,14.31 2.69,14.31 2.69,22.71 U$7.2
JTCK
  Top 0.203: 54.89,9.81 U1.49 54.89,9.21 54.09,9.21 54.09,3.61 JP1.3
JTMS
  Top 0.203: U1.46 52.49,12.71 49.59,12.71 49.59,3.81 JP1.1
LED_BUS_PWR
  Top 0.203: R35.2 15.69,18.61 13.19,18.61 LED1.C
LED|R
  Top 0.203: R7.2 62.39,4.41 61.19,4.41 LED2.A
N$3
  Bottom 0.203: U$13.5 22.49,7.21 17.79,7.21 16.99,6.41 JP4.3
N$8
  Bottom 0.203: U$1.5 22.59,2.71 21.79,1.91 11.49,1.91 10.79,2.61 10.79,4.31 15.99,4.31 JP4.4
N$10
  Bottom 0.203: R3.1 37.69,4.21 35.29,4.21 U$1.1
N$11
  Bottom 0.203: R47.1 37.79,7.91 36.69,7.91 36.09,8.51 35.19,8.51 U$13.1
N$12
  Bottom 0.203: Q12.3 37.79,15.81 37.79,14.61 32.29,14.61 31.79,14.11 31.79,2.01 33.19,2.01 U$1.3
N$13
  Bottom 0.203: Q2.3 38.09,10.91 38.09,9.51 33.19,9.51 32.69,9.01 32.69,6.11 33.09,6.11 U$13.3
N$14  (via drill 0.6)
  Top 0.203: v54.39,15.41 54.39,17.71 53.59,17.71 U1.36
  Bottom 0.203: Q2.1 40.89,12.11 49.69,12.11 52.99,15.41 v54.39,15.41
N$15  (via drill 0.6)
  Top 0.203: v51.69,18.21 52.49,18.21 U1.35
  Bottom 0.203: 51.39,17.91 v51.69,18.21 51.19,18.41 50.29,18.41 48.09,20.61 40.29,20.61 40.29,17.61 Q12.1
NRST  (via drill 0.6)
  Top 0.203: SW1.P$1 74.29,2.01 69.99,2.01 SW1.P$2 69.19,2.41 66.59,2.41 66.59,4.01 R17.1 66.59,4.91 66.99,5.31 v66.99,7.31 | v65.79,14.71 64.99,14.71 U1.7
  Bottom 0.203: v65.79,14.71 65.79,7.51 66.79,7.51 v66.99,7.31
PA2|WDT  (via drill 0.6)
  Top 0.203: U1.16 64.69,19.21 v64.69,20.61 67.19,20.61
  Bottom 0.203: U$3.56 74.99,25.21 72.59,25.21 67.99,20.61 v64.69,20.61
PA9_USART1_TX  (via drill 0.6)
  Top 0.203: U1.42 52.49,14.71 51.39,14.71 v51.39,15.11
  Bottom 0.203: v51.39,15.11 51.29,15.21 47.99,15.21 47.19,16.01 46.29,16.01 JP3.5
PA10_USART1_RX  (via drill 0.6)
  Top 0.203: U1.43 52.49,14.21 50.49,14.21 v50.49,16.11 | v48.29,16.11 46.79,14.61 46.19,14.61 46.19,13.91 JP3.4
  Bottom 0.203: v48.29,16.11 v50.49,16.11
PA11_CANRXD  (via drill 0.6)
  Top 0.203: U1.44 52.49,13.71 49.59,13.71 49.59,17.01 v45.09,21.51
  Bottom 0.203: v45.09,21.51 45.09,21.11 33.79,21.11 31.79,19.11 31.79,16.31 32.19,16.31 U$2.2
PA12-CANTXD  (via drill 0.6)
  Top 0.203: U1.45 52.49,13.21 v48.29,13.21
  Bottom 0.203: v48.29,13.21 46.89,14.61 41.89,14.61 40.99,13.71 36.29,13.71 36.09,13.51 35.09,13.51 U$2.3
PB8|LED  (via drill 0.6)
  Top 0.203: v60.99,7.71 60.99,9.21 U1.61 | v58.49,6.21 57.99,5.71 57.99,5.41 LED2.C
  Bottom 0.203: v60.99,7.71 59.49,6.21 v58.49,6.21
PB11|VCAP  (via drill 0.6)
  Top 0.203: v55.69,22.51 55.89,22.51 55.99,22.41 55.99,21.71 U1.30
  Bottom 0.203: v55.69,22.51 54.89,22.51 C7.1 53.99,22.91 52.69,22.91 C8.1
PD0_OSC_IN_XTAL
  Top 0.203: U1.5 64.99,13.71 68.39,13.71 68.39,13.61 R1.1 C1.1 69.29,11.31 72.59,11.31 Q1.2
PD1_OSC_OUT  (via drill 0.6)
  Top 0.203: R1.2 68.89,15.91 C2.1 69.29,16.41 72.59,16.41 Q1.1 | v63.09,15.11 63.09,14.21 63.89,14.21 U1.6
  Bottom 0.203: v63.09,15.11 63.89,15.91 72.59,15.91 Q1.1
S1
  Bottom 0.203: U$3.37 82.99,19.21 82.99,14.01 82.59,13.61 82.59,11.01 84.59,11.01 88.29,7.31 88.79,7.31 89.69,6.41 89.69,6.01 90.59,6.01 RS1.2
S2
  Bottom 0.203: U$3.35 83.99,19.21 83.99,14.01 89.09,14.01 90.19,12.91 90.19,12.61 91.19,12.61 RS2.2
S3  (via drill 0.6)
  Top 0.203: v88.49,18.21 93.69,13.01 v93.69,8.71
  Bottom 0.203: v88.49,18.21 84.99,18.21 84.99,19.21 U$3.33 | v93.69,8.71 95.19,7.21 98.89,7.21 99.89,6.21 99.89,6.01 100.99,6.01 RS3.2
S4  (via drill 0.6)
  Top 0.203: v104.49,13.91 106.09,12.31 106.09,8.61 107.59,7.11 110.29,7.11 110.29,5.91 RS4.2
  Bottom 0.203: v104.49,13.91 99.79,13.91 99.29,13.41 97.99,13.41 94.09,17.31 89.69,17.31 89.69,20.91 88.39,22.21 87.49,22.21 U$3.31
S5  (via drill 0.6)
  Top 0.203: v91.09,21.01 89.29,21.01 88.59,21.71 85.49,21.71 85.49,20.41 84.99,19.91 84.99,18.71 90.49,13.21 90.49,10.81 92.79,10.81 92.79,2.31 93.99,1.11 101.79,1.11 101.79,0.51 119.69,0.51 119.69,4.31 120.19,4.31 120.19,4.91 RS5.2
  Bottom 0.203: v91.09,21.01 88.89,23.21 87.49,23.21 U$3.29
S6  (via drill 0.6)
  Top 0.203: v111.69,16.41 112.19,15.91 112.19,14.11 112.49,13.81 113.69,13.81 113.69,12.11 RS6.2
  Bottom 0.203: v111.69,16.41 105.59,16.41 102.49,19.51 97.59,19.51 94.69,22.41 91.09,22.41 89.29,24.21 87.49,24.21 U$3.27
S7  (via drill 0.6)
  Top 0.203: v90.49,24.81 93.49,21.81 93.49,21.21 95.19,19.51 100.69,19.51 100.69,16.31 103.59,16.31 103.59,12.71 RS7.2
  Bottom 0.203: v90.49,24.81 90.09,25.21 87.49,25.21 U$3.25
S8  (via drill 0.6)
  Top 0.203: v85.89,19.61 89.59,15.91 v89.59,15.31 | v96.09,13.41 99.39,13.41 99.39,13.51 100.19,14.31 101.19,14.31 101.19,14.71 RS8.2
  Bottom 0.203: v85.89,19.61 85.49,19.61 85.49,26.21 86.39,26.21 U$3.23 | v89.59,15.31 91.09,13.81 95.69,13.81 v96.09,13.41
S9  (via drill 0.6)
  Top 0.203: v88.79,26.81 90.19,28.21 v90.39,28.21 | v110.99,23.11 111.29,22.81 111.29,20.11 112.59,18.81 112.59,16.11 113.09,16.11 113.09,15.41 RS9.2
  Bottom 0.203: v88.79,26.81 88.39,27.21 87.49,27.21 U$3.21 | v90.39,28.21 90.79,27.81 103.59,27.81 108.29,23.11 v110.99,23.11
S10
  Bottom 0.203: U$3.19 87.49,28.21 89.19,28.21 90.09,27.31 92.19,27.31 95.89,23.61 99.69,23.61 99.99,23.31 99.99,23.01 100.99,23.01 RS10.2
S11  (via drill 0.6)
  Top 0.203: v88.99,29.61 89.79,30.41 92.29,30.41 92.29,28.41 v94.29,26.41
  Bottom 0.203: v88.99,29.61 88.59,29.21 87.49,29.21 U$3.17 | v94.29,26.41 94.59,26.71 102.29,26.71 108.19,20.81 110.99,20.81 111.29,21.11 111.29,21.31 112.39,21.31 RS11.2
S12
  Bottom 0.203: U$3.15 84.49,31.71 84.49,32.11 92.89,32.11 96.59,28.41 99.29,28.41 99.59,28.71 99.59,28.91 100.69,28.91 RS12.2
S13
  Bottom 0.203: U$3.13 83.49,31.71 83.49,33.91 101.99,33.91 107.79,28.11 110.49,28.11 110.89,28.51 110.89,28.71 111.99,28.71 RS13.2
S14  (1 unrouted)
S15  (via drill 0.6)
  Top 0.203: v81.99,32.51 90.09,32.51 92.39,34.81 v99.19,34.81
  Bottom 0.203: v81.99,32.51 81.49,32.51 81.49,31.71 U$3.9 | v99.19,34.81 99.59,34.41 101.69,34.41 102.89,35.61 102.89,36.41 103.59,36.41 RS15.2
S16
  Bottom 0.203: U$3.7 80.49,31.71 80.49,32.91 80.59,32.91 82.59,34.91 88.29,34.91 89.09,35.71 90.19,35.71 90.99,34.91 92.69,34.91 93.49,35.71 93.49,36.01 94.49,36.01 RS16.2
S17  (via drill 0.6)
  Top 0.203: v80.19,34.31 81.99,34.31 82.59,34.91 84.89,34.91 84.89,36.11 RS17.2
  Bottom 0.203: v80.19,34.31 79.49,34.31 79.49,31.71 U$3.5
S18
  Bottom 0.203: U$3.3 78.49,31.71 78.49,36.71 75.29,36.71 RS18.2
SP1_MISO-SDO  (via drill 0.6)
  Top 0.203: U1.22 59.99,21.71 v59.99,23.91 | v72.79,24.21 71.59,24.21 v67.49,28.31
  Bottom 0.203: 66.69,28.31 66.69,26.91 66.09,26.91 63.99,24.81 61.79,24.81 60.89,23.91 v59.99,23.91 | 66.69,28.31 66.69,30.11 R46.1 | v72.79,24.21 74.99,24.21 U$3.54 | 66.69,28.31 v67.49,28.31
SP1_NSS-CSB  (via drill 0.6)
  Top 0.203: U1.20 60.99,20.61 60.99,19.81 61.49,19.31 v62.49,19.31 62.89,19.61 62.89,19.91 63.39,19.91 63.39,21.91 v65.69,24.21
  Bottom 0.203: v62.49,19.31 62.89,19.71 | v65.69,24.21 66.99,24.21 66.99,26.01 67.79,26.81 68.49,26.81 68.49,26.91 68.69,26.91 68.69,27.51 68.89,27.71 74.99,27.71 U$3.61
SPI1_MOSI-SDI  (via drill 0.6)
  Top 0.203: U1.23 59.49,21.71 59.49,22.51 v59.09,22.91 59.09,26.61 68.59,26.61 v71.89,23.31
  Bottom 0.203: v59.09,22.91 59.59,23.11 | v71.89,23.31 73.09,23.31 73.49,23.71 74.99,23.71 U$3.53
SPI1_SCK-CLK  (via drill 0.6)
  Top 0.203: 60.49,22.51 60.49,21.71 U1.21 | 60.49,22.51 60.49,22.91 60.59,22.91 | 61.49,22.61 61.39,22.51 60.89,22.51 | 60.49,22.51 60.89,22.51 | v60.69,25.01 60.89,24.81 60.89,22.51
  Bottom 0.203: v60.69,25.01 60.69,26.91 65.89,32.11 69.29,32.11 73.19,28.21 74.99,28.21 U$3.62
VCC  (via drill 0.6)  (2 unrouted)
  Top 0.203: 55.09,7.24 55.09,7.21 | R7.1 62.89,6.51 62.89,7.21 62.89,7.27 | R17.2 66.09,6.61 66.09,7.21 66.15,7.28 | v51.89,7.71 51.99,7.71 | C6.1 48.09,25.11 48.09,24.11 48.39,23.81 51.59,23.81 51.69,23.81 | v66.09,25.71 66.09,25.61 66.09,25.58
  Bottom 0.203: C3.1 60.39,18.91 60.59,18.91 60.59,17.71 C5.1 61.59,16.81 v61.59,15.71 61.59,14.61 C21.1 62.49,13.61 64.49,13.61 64.49,10.01 C4.1 | v59.29,11.11 v56.59,8.41 56.59,6.01 57.49,5.11 57.49,3.21 R8.2 | R47.2 39.89,6.91 39.89,4.21 R3.2 40.29,4.11 46.89,4.11 50.49,7.71 v51.89,7.71 | v66.09,25.71 68.19,27.81 68.39,27.81 68.39,30.11 R46.2
  pour Top (rank 2): 51.66,25.2 52,7.23 66.15,7.28 66.11,25.58
  pour Bottom (rank 2): 57.24,24.8 57.21,23.01 57.87,22.31 58.8,22.4 62.94,23.92 63,25.13 62.52,25.51 58.76,25.41 57.84,25.35
VREF1  (via drill 0.6)
  Top 0.203: v72.89,26.51 74.19,27.81 v74.19,29.71
  Bottom 0.203: v72.89,26.51 71.49,26.51 C35.1 | v74.19,29.71 76.39,29.71 76.39,29.61 76.49,29.61 76.49,25.21 76.79,25.21 76.79,22.71 76.09,22.71 U$3.51
VREF2
  Bottom 0.203: 62.99,20.21 62.19,20.21 61.59,19.61 61.59,18.41 | 62.99,20.21 63.19,20.21 | 61.59,18.41 61.59,18.11 | 62.99,20.21 62.99,21.21 63.09,21.31 63.49,21.31 63.49,22.81 C34.1 | R50.2 79.69,12.01 78.49,12.01 R51.2 77.89,12.61 77.89,13.61 74.59,16.91 74.49,16.91 74.49,18.41 | 74.49,18.41 74.49,21.11 74.59,21.11 74.59,22.21 74.99,22.21 U$3.50 | 61.59,18.41 74.49,18.41
VREG  (via drill 0.6)
  Top 0.203: v48.49,33.31 48.49,32.51 U$5.2 | v75.39,20.71 75.39,21.41 v73.99,22.81 73.79,23.31 73.69,23.41 73.69,24.51 65.99,32.21 62.19,32.21 v61.69,32.11
  Bottom 0.203: 48.79,33.51 48.89,33.41 50.09,33.41 50.09,31.01 C36.1 50.79,30.61 59.99,30.61 61.49,32.11 v61.69,32.11 | 48.79,33.51 48.79,34.51 C37.1 | v48.49,33.31 48.69,33.51 48.79,33.51 | v73.99,22.81 73.99,23.21 74.99,23.21 U$3.52 | v75.39,20.71 76.09,20.01 77.39,20.01 U$3.48
VSS_1  (via drill 0.6)
  Top 0.203: v55.49,19.81 55.49,20.61 U1.31
  Bottom 0.203: v55.49,19.81 55.49,18.81 C11.1
VSS_2  (via drill 0.6)
  Top 0.203: v54.39,12.21 53.59,12.21 U1.47
  Bottom 0.203: v54.39,12.21 55.29,12.21 C13.1
X1  (via drill 0.6)
  Top 0.203: RC1.1 88.69,2.91 90.29,2.91 RS1.1 | v122.59,4.21 122.59,6.11 122.19,6.51 122.19,9.21 U$12.2
  Bottom 0.203: v122.59,4.21 122.59,0.51 100.59,0.51 100.59,1.21 94.29,1.21 92.79,2.71 91.79,2.71 RS1.1
X2
  Top 0.203: RS2.1 90.89,9.51 89.29,9.51 RC2.1
  Bottom 0.203: U$12.3 118.89,12.91 118.89,13.11 115.49,13.11 115.29,13.31 110.29,13.31 107.79,10.81 94.59,10.81 93.39,9.61 92.39,9.61 RS2.1
X3
  Top 0.203: RC3.1 98.79,2.91 100.69,2.91 RS3.1 101.79,2.11 102.29,2.11 102.29,1.11 118.19,1.11 119.09,2.01 119.09,6.41 121.19,8.51 121.19,11.81 121.59,11.81 U$12.4
X4  (via drill 0.6)
  Top 0.203: RC4.1 108.29,2.81 110.09,2.81 RS4.1 | v115.79,4.81 115.79,6.21 117.59,8.01 117.59,14.11 118.59,14.11 U$12.5
  Bottom 0.203: v115.79,4.81 113.79,2.81 111.59,2.81 RS4.1
X5  (via drill 0.6)
  Top 0.203: v125.19,13.11 124.79,12.71 124.79,5.21 122.49,2.91 121.59,2.91 RS5.1
  Bottom 0.203: RC5.1 118.29,2.91 120.09,2.91 RS5.1 | v125.19,13.11 124.19,14.11 123.29,14.11 U$12.6
X6
  Top 0.203: U$12.7 118.59,16.31 117.09,16.31 117.09,9.81 116.39,9.11 115.09,9.11 RS6.1
  Bottom 0.203: RC6.1 111.79,9.11 113.59,9.11 RS6.1
X7
  Top 0.203: RC7.1 101.09,9.51 102.99,9.51 RS7.1
  Bottom 0.203: U$12.8 122.99,16.01 122.99,15.61 123.89,15.61 126.09,13.41 126.09,12.51 125.99,12.51 124.29,10.81 124.29,7.21 118.39,7.21 118.29,7.31 107.39,7.31 105.39,9.31 104.49,9.31 RS7.1
X8  (via drill 0.6)
  Top 0.203: v103.89,19.31 103.29,18.71 102.49,18.71 102.49,18.11 RS8.1
  Bottom 0.203: RC8.1 99.39,17.71 101.09,17.71 RS8.1 | v103.89,19.31 118.59,19.31 118.59,19.21 U$12.9
X9  (via drill 0.6)
  Top 0.203: v123.09,8.11 124.29,9.31 124.29,18.51 123.29,18.51 U$12.10 | v116.19,10.11 116.19,15.21 114.99,16.41 114.39,16.41 114.39,17.11 RS9.1
  Bottom 0.203: RC9.1 111.19,17.61 112.99,17.61 RS9.1 | v123.09,8.11 118.19,8.11 v116.19,10.11
X10
  Top 0.203: RC10.1 99.09,25.01 100.69,25.01 RS10.1
  Bottom 0.203: U$12.11 118.89,20.31 118.89,20.11 107.99,20.11 103.19,24.91 102.29,24.91 RS10.1
X11  (via drill 0.6)
  Top 0.203: RC11.1 110.29,24.51 112.09,24.51 RS11.1 112.79,25.21 112.79,26.21 114.19,27.61 v114.19,31.61 | v123.79,35.51 124.29,35.01 124.29,21.31 123.29,21.31 U$12.12
  Bottom 0.203: v123.79,35.51 123.19,36.11 118.69,36.11 v114.19,31.61
X12
  Top 0.203: RS12.1 100.39,32.01 98.69,32.01 RC12.1
  Bottom 0.203: U$12.13 118.89,23.91 118.89,24.11 115.69,24.11 112.29,27.51 107.39,27.51 102.89,32.01 101.89,32.01 RS12.1
X13  (via drill 0.6)
  Top 0.203: RC13.1 109.89,31.91 111.69,31.91 RS13.1 | v125.19,24.51 124.79,24.91 124.79,35.71 v123.69,36.81
  Bottom 0.203: v125.19,24.51 124.19,23.51 123.29,23.51 U$12.14 | v123.69,36.81 123.49,36.61 118.29,36.61 114.19,32.51 112.89,32.51 RS13.1
X14
  Top 0.203: RC14.1 110.69,39.31 112.39,39.31 RS14.1 113.79,38.91 113.79,38.21 114.39,38.21 116.19,36.41 116.19,25.71 118.59,25.71 U$12.15
X15
  Top 0.203: RC15.1 101.39,39.61 103.19,39.61 RS15.1
  Bottom 0.203: U$12.16 122.99,26.01 122.99,26.41 123.89,26.41 124.69,27.21 124.69,41.01 107.09,41.01 105.79,39.71 104.69,39.71 RS15.1
X16  (via drill 0.6)
  Top 0.203: RC16.1 92.59,39.11 94.19,39.11 RS16.1 | v115.29,30.91 115.09,31.11 115.09,31.91 112.09,34.91 100.09,34.91 100.09,35.11 98.59,36.61 v98.59,36.81
  Bottom 0.203: v115.29,30.91 117.69,28.51 118.89,28.51 118.89,28.31 U$12.17 | v98.59,36.81 96.69,38.71 95.49,38.71 RS16.1
X17
  Top 0.203: RC17.1 82.89,39.31 84.59,39.31 RS17.1 85.89,39.81 85.89,41.61 106.49,41.61 106.49,41.01 115.79,41.01 121.19,35.61 121.19,28.01 121.59,28.01 U$12.18
X18  (via drill 0.6)
  Top 0.203: v76.59,31.41 76.29,31.71 76.29,37.51 75.69,38.11 75.29,38.11 75.29,39.01 RS18.1 73.69,39.41 71.99,39.41 RC18.1 | v117.09,36.61 117.09,30.11 118.59,30.11 U$12.19
  Bottom 0.203: v76.59,31.41 77.39,31.41 U$3.1 | v117.09,36.61 115.39,34.91 108.69,34.91 105.39,38.21 98.39,38.21 95.59,41.01 94.29,41.01 94.19,40.91 77.69,40.91 76.19,39.41 75.29,39.41 RS18.1

### Text on the board
bNames: 5
tValues: 3.3V | DIGITAL | +5V | 3.2v | ANALOG | 3.2